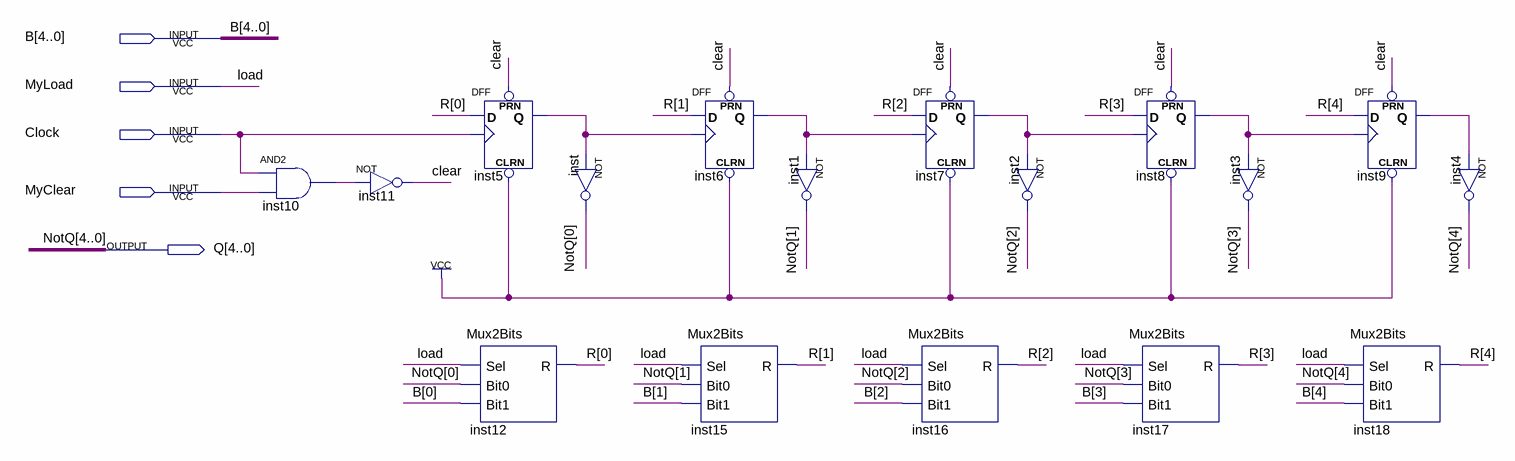
[diagram p0: schematic sheet]
// Quartus schematic Contador.bdf as structural Verilog: 17 symbols, 5 pins
module Contador (
  input  [4:0] B,
  input  MyLoad,
  input  Clock,
  input  MyClear,
  output [4:0] Q
);

  wire clear, inst5_q, inst6_q, inst7_q, inst8_q, inst9_q, inst10_out;
  wire [4:0] R;

  and inst10 (inst10_out, Clock, MyClear);
  not inst11 (clear, inst10_out);
  DFF inst5 (.CLRN(1'b1), .CLK(Clock), .D(R[0]), .PRN(clear), .Q(inst5_q));
  Mux2Bits inst12 (.Sel(MyLoad), .Bit0(Q[0]), .Bit1(B[0]), .R(R[0]));
  not inst (Q[0], inst5_q);
  DFF inst6 (.CLRN(1'b1), .CLK(inst5_q), .D(R[1]), .PRN(clear), .Q(inst6_q));
  Mux2Bits inst15 (.Sel(MyLoad), .Bit0(Q[1]), .Bit1(B[1]), .R(R[1]));
  not inst1 (Q[1], inst6_q);
  DFF inst7 (.CLRN(1'b1), .CLK(inst6_q), .D(R[2]), .PRN(clear), .Q(inst7_q));
  Mux2Bits inst16 (.Sel(MyLoad), .Bit0(Q[2]), .Bit1(B[2]), .R(R[2]));
  not inst2 (Q[2], inst7_q);
  DFF inst8 (.CLRN(1'b1), .CLK(inst7_q), .D(R[3]), .PRN(clear), .Q(inst8_q));
  Mux2Bits inst17 (.Sel(MyLoad), .Bit0(Q[3]), .Bit1(B[3]), .R(R[3]));
  not inst3 (Q[3], inst8_q);
  DFF inst9 (.CLRN(1'b1), .CLK(inst8_q), .D(R[4]), .PRN(clear), .Q(inst9_q));
  Mux2Bits inst18 (.Sel(MyLoad), .Bit0(Q[4]), .Bit1(B[4]), .R(R[4]));
  not inst4 (Q[4], inst9_q);

  // Other names for the same wires on the sheet: load = MyLoad; NotQ[4:0] = Q
endmodule
